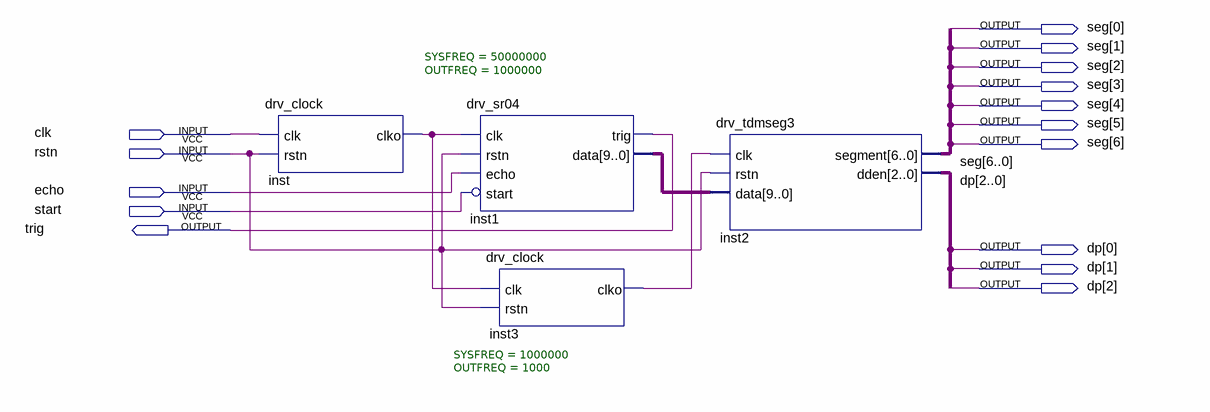
[diagram p0: schematic sheet]
// Quartus schematic dig2lab7.bdf as structural Verilog: 4 symbols, 15 pins
module dig2lab7 (
  input  clk,
  input  rstn,
  input  echo,
  input  start,
  output [6:0] seg,
  output trig,
  output [2:0] dp
);

  wire inst3_clko, inst_clko;
  wire [9:0] inst1_data;

  drv_clock #(.SYSFREQ(50000000), .OUTFREQ(1000000)) inst (.clk(clk), .rstn(rstn), .clko(inst_clko));
  drv_sr04 inst1 (.clk(inst_clko), .echo(echo), .rstn(rstn), .start(~start), .data(inst1_data), .trig(trig));
  drv_clock #(.SYSFREQ(1000000), .OUTFREQ(1000)) inst3 (.clk(inst_clko), .rstn(rstn), .clko(inst3_clko));
  drv_tdmseg3 inst2 (.clk(inst3_clko), .rstn(rstn), .data(inst1_data), .segment(seg), .dden(dp));
endmodule
